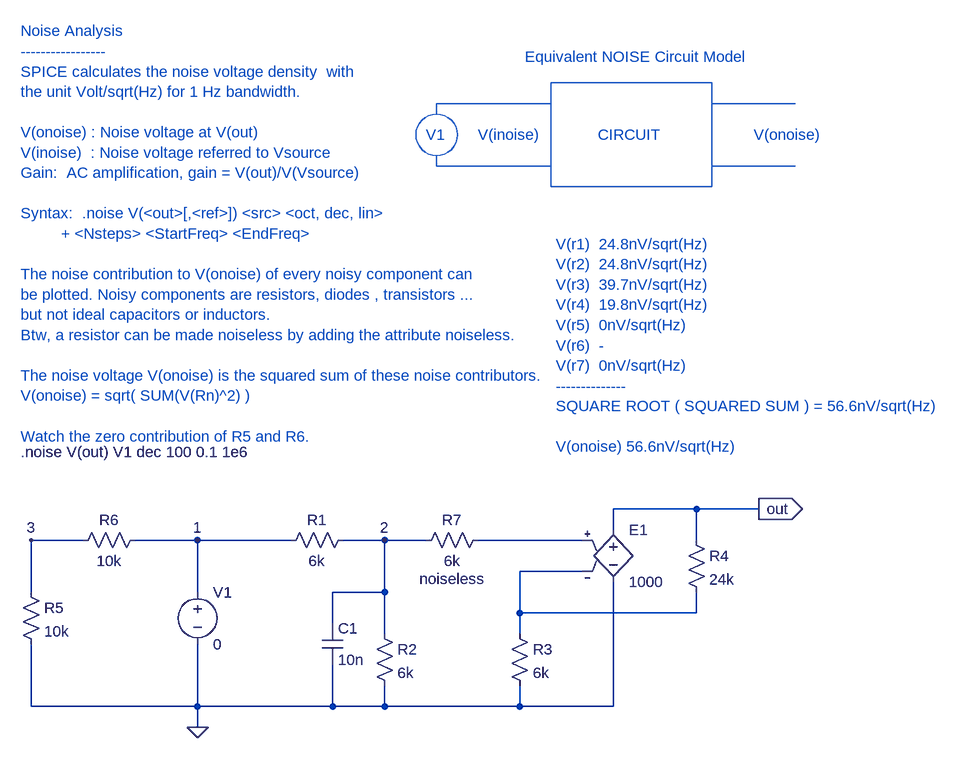
[diagram p0: schematic noise_analysis1.asc]
noise_analysis1.asc, the LTspice schematic file:
Version 4
SHEET 1 1136 680
WIRE 16 64 -128 64
WIRE -128 64 -128 144
WIRE -128 224 -128 320
WIRE -128 320 -128 352
WIRE 96 64 160 64
WIRE 512 48 512 16
WIRE 512 16 640 16
WIRE 512 128 512 320
WIRE 512 320 368 320
WIRE 464 64 304 64
WIRE 160 208 160 144
WIRE 160 288 160 320
WIRE 160 320 80 320
WIRE 368 208 368 176
WIRE 368 112 368 176
WIRE 368 112 464 112
WIRE 368 176 640 176
WIRE 368 288 368 320
WIRE 368 320 160 320
WIRE 640 64 640 16
WIRE 640 16 736 16
WIRE 640 144 640 176
WIRE -384 144 -384 64
WIRE -384 64 -304 64
WIRE -384 224 -384 320
WIRE -384 320 -128 320
WIRE -224 64 -128 64
WIRE 80 192 80 144
WIRE 80 144 160 144
WIRE 160 144 160 64
WIRE 80 256 80 320
WIRE 80 320 -128 320
WIRE 224 64 160 64
FLAG -128 352 0
FLAG -128 64 1
FLAG 736 16 out
IOPIN 736 16 Out
FLAG 160 64 2
FLAG -384 64 3
SYMBOL res 0 80 R270
WINDOW 0 32 56 VTop 0
WINDOW 3 0 56 VBottom 0
SYMATTR InstName R1
SYMATTR Value 6k
SYMBOL voltage -128 128 R0
SYMATTR InstName V1
SYMATTR Value 0
SYMBOL e 512 32 R0
SYMATTR InstName E1
SYMATTR Value 1000
SYMBOL res 144 192 R0
SYMATTR InstName R2
SYMATTR Value 6k
SYMBOL res 352 192 R0
SYMATTR InstName R3
SYMATTR Value 6k
SYMBOL res 624 48 R0
SYMATTR InstName R4
SYMATTR Value 24k
SYMBOL res -400 128 R0
SYMATTR InstName R5
SYMATTR Value 10k
SYMBOL res -320 80 R270
WINDOW 0 32 56 VTop 0
WINDOW 3 0 56 VBottom 0
SYMATTR InstName R6
SYMATTR Value 10k
SYMBOL cap 64 192 R0
SYMATTR InstName C1
SYMATTR Value 10n
SYMBOL res 208 80 R270
WINDOW 0 32 56 VTop 0
WINDOW 3 0 56 VBottom 0
WINDOW 39 -28 56 VBottom 0
SYMATTR InstName R7
SYMATTR Value 6k
SYMATTR SpiceLine noiseless
TEXT -400 -72 Left 0 !.noise V(out) V1 dec 100 0.1 1e6
TEXT -400 -720 Left 0 ;Noise Analysis\n----------------- \nSPICE calculates the noise voltage density  with \nthe unit Volt/sqrt(Hz) for 1 Hz bandwidth.\n \nV(onoise) : Noise voltage at V(out)\nV(inoise)  : Noise voltage referred to Vsource\nGain:  AC amplification, gain = V(out)/V(Vsource)\n \nSyntax:  .noise V(<out>[,<ref>]) <src> <oct, dec, lin>\n         + <Nsteps> <StartFreq> <EndFreq>\n \nThe noise contribution to V(onoise) of every noisy component can \nbe plotted. Noisy components are resistors, diodes , transistors ...\nbut not ideal capacitors or inductors. \nBtw, a resistor can be made noiseless by adding the attribute noiseless. \n \nThe noise voltage V(onoise) is the squared sum of these noise contributors.\nV(onoise) = sqrt( SUM(V(Rn)^2) )\n \nWatch the zero contribution of R5 and R6.
TEXT 304 -560 Left 0 ;V(inoise)
TEXT 728 -560 Left 0 ;V(onoise)
TEXT 488 -560 Left 0 ;CIRCUIT
TEXT 424 -392 Left 0 ;V(r1)  24.8nV/sqrt(Hz)\nV(r2)  24.8nV/sqrt(Hz)\nV(r3)  39.7nV/sqrt(Hz)\nV(r4)  19.8nV/sqrt(Hz)\nV(r5)  0nV/sqrt(Hz)\nV(r6)  -\nV(r7)  0nV/sqrt(Hz)\n--------------\nSQUARE ROOT ( SQUARED SUM ) = 56.6nV/sqrt(Hz)\n \nV(onoise) 56.6nV/sqrt(Hz)
TEXT 376 -680 Left 0 ;Equivalent NOISE Circuit Model
TEXT 224 -560 Left 0 ;V1
LINE Normal 240 -608 240 -592
LINE Normal 416 -608 240 -608
LINE Normal 240 -512 240 -528
LINE Normal 416 -512 240 -512
LINE Normal 792 -608 664 -608
LINE Normal 792 -512 664 -512
RECTANGLE Normal 664 -480 416 -640
CIRCLE Normal 272 -528 208 -592

The netlist it stands for:
* noise_analysis1.asc
R1 1 2 6k
V1 1 0 0
E1 out 0 N001 N002 1000
R2 2 0 6k
R3 N002 0 6k
R4 out N002 24k
R5 3 0 10k
R6 3 1 10k
C1 2 0 10n
R7 2 N001 6k noiseless
.noise V(out) V1 dec 100 0.1 1e6
* Noise Analysis
* -----------------
* SPICE calculates the noise voltage density  with
* the unit Volt/sqrt(Hz) for 1 Hz bandwidth.
* V(onoise) : Noise voltage at V(out)
* V(inoise)  : Noise voltage referred to Vsource
* Gain:  AC amplification, gain = V(out)/V(Vsource)
* Syntax:  .noise V(<out>[,<ref>]) <src> <oct, dec, lin>
*          + <Nsteps> <StartFreq> <EndFreq>
* The noise contribution to V(onoise) of every noisy component can
* be plotted. Noisy components are resistors, diodes , transistors ...
* but not ideal capacitors or inductors.
* Btw, a resistor can be made noiseless by adding the attribute noiseless.
* The noise voltage V(onoise) is the squared sum of these noise contributors.
* V(onoise) = sqrt( SUM(V(Rn)^2) )
* Watch the zero contribution of R5 and R6.
* V(inoise)
* V(onoise)
* CIRCUIT
* V(r1)  24.8nV/sqrt(Hz)
* V(r2)  24.8nV/sqrt(Hz)
* V(r3)  39.7nV/sqrt(Hz)
* V(r4)  19.8nV/sqrt(Hz)
* V(r5)  0nV/sqrt(Hz)
* V(r6)  -
* V(r7)  0nV/sqrt(Hz)
* --------------
* SQUARE ROOT ( SQUARED SUM ) = 56.6nV/sqrt(Hz)
* V(onoise) 56.6nV/sqrt(Hz)
* Equivalent NOISE Circuit Model
* V1
.backanno
.end